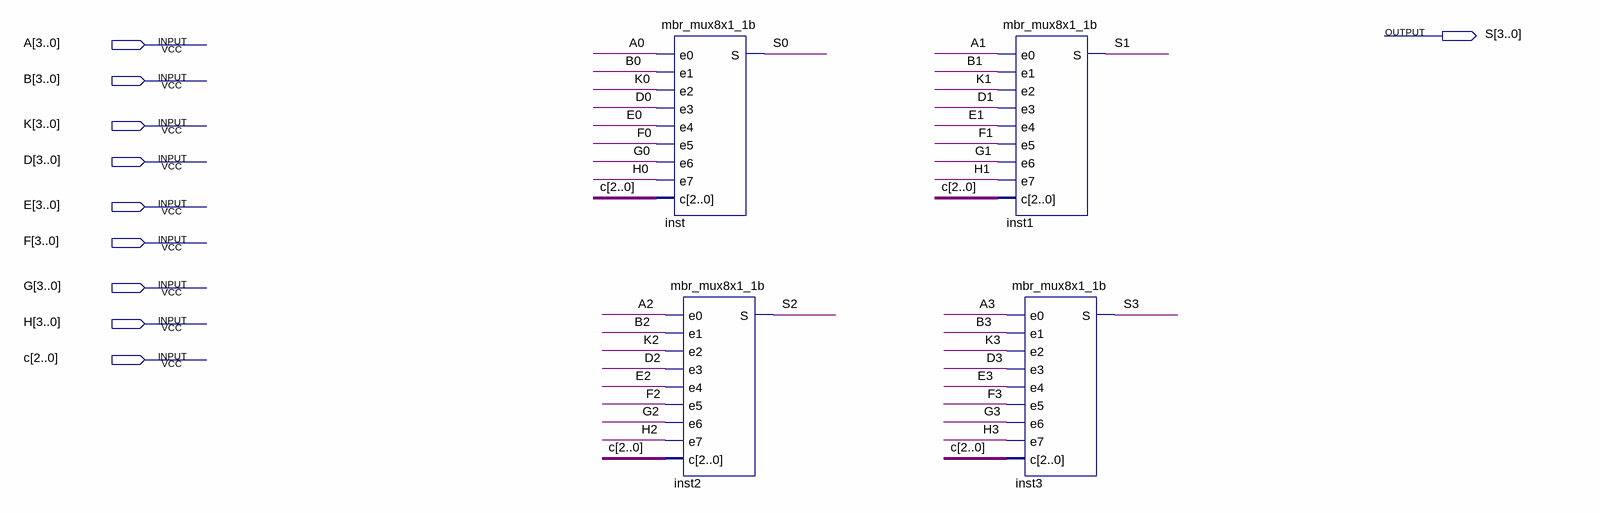
[diagram p0: schematic sheet]
// Quartus schematic mbr_mux8x1_4b.bdf as structural Verilog: 4 symbols, 10 pins
module mbr_mux8x1_4b (
  input  [3:0] A,
  input  [3:0] B,
  input  [3:0] K,
  input  [3:0] D,
  input  [3:0] E,
  input  [3:0] F,
  input  [3:0] G,
  input  [3:0] H,
  input  [2:0] c,
  output [3:0] S
);

  mbr_mux8x1_1b inst (
    .e0(A[0]), .e1(B[0]), .e2(K[0]), .e3(D[0]), .e4(E[0]), .e5(F[0]), .e6(G[0]), .e7(H[0]), .c(c), .S(S[0]));
  mbr_mux8x1_1b inst2 (
    .e0(A[2]), .e1(B[2]), .e2(K[2]), .e3(D[2]), .e4(E[2]), .e5(F[2]), .e6(G[2]), .e7(H[2]), .c(c), .S(S[2]));
  mbr_mux8x1_1b inst1 (
    .e0(A[1]), .e1(B[1]), .e2(K[1]), .e3(D[1]), .e4(E[1]), .e5(F[1]), .e6(G[1]), .e7(H[1]), .c(c), .S(S[1]));
  mbr_mux8x1_1b inst3 (
    .e0(A[3]), .e1(B[3]), .e2(K[3]), .e3(D[3]), .e4(E[3]), .e5(F[3]), .e6(G[3]), .e7(H[3]), .c(c), .S(S[3]));
endmodule
